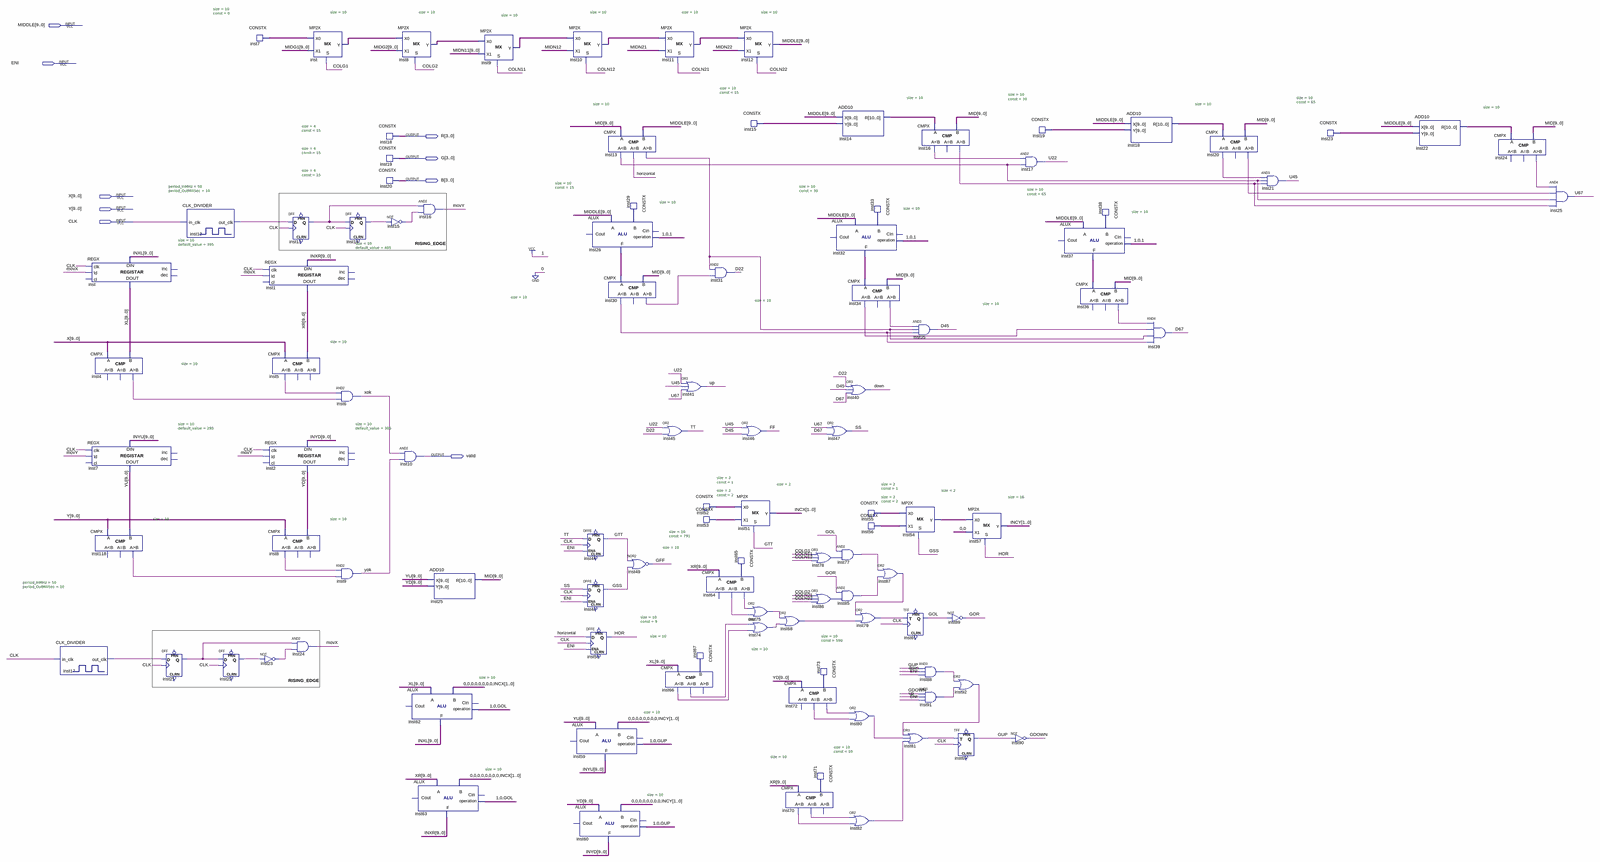
[diagram p0: schematic sheet, whole]
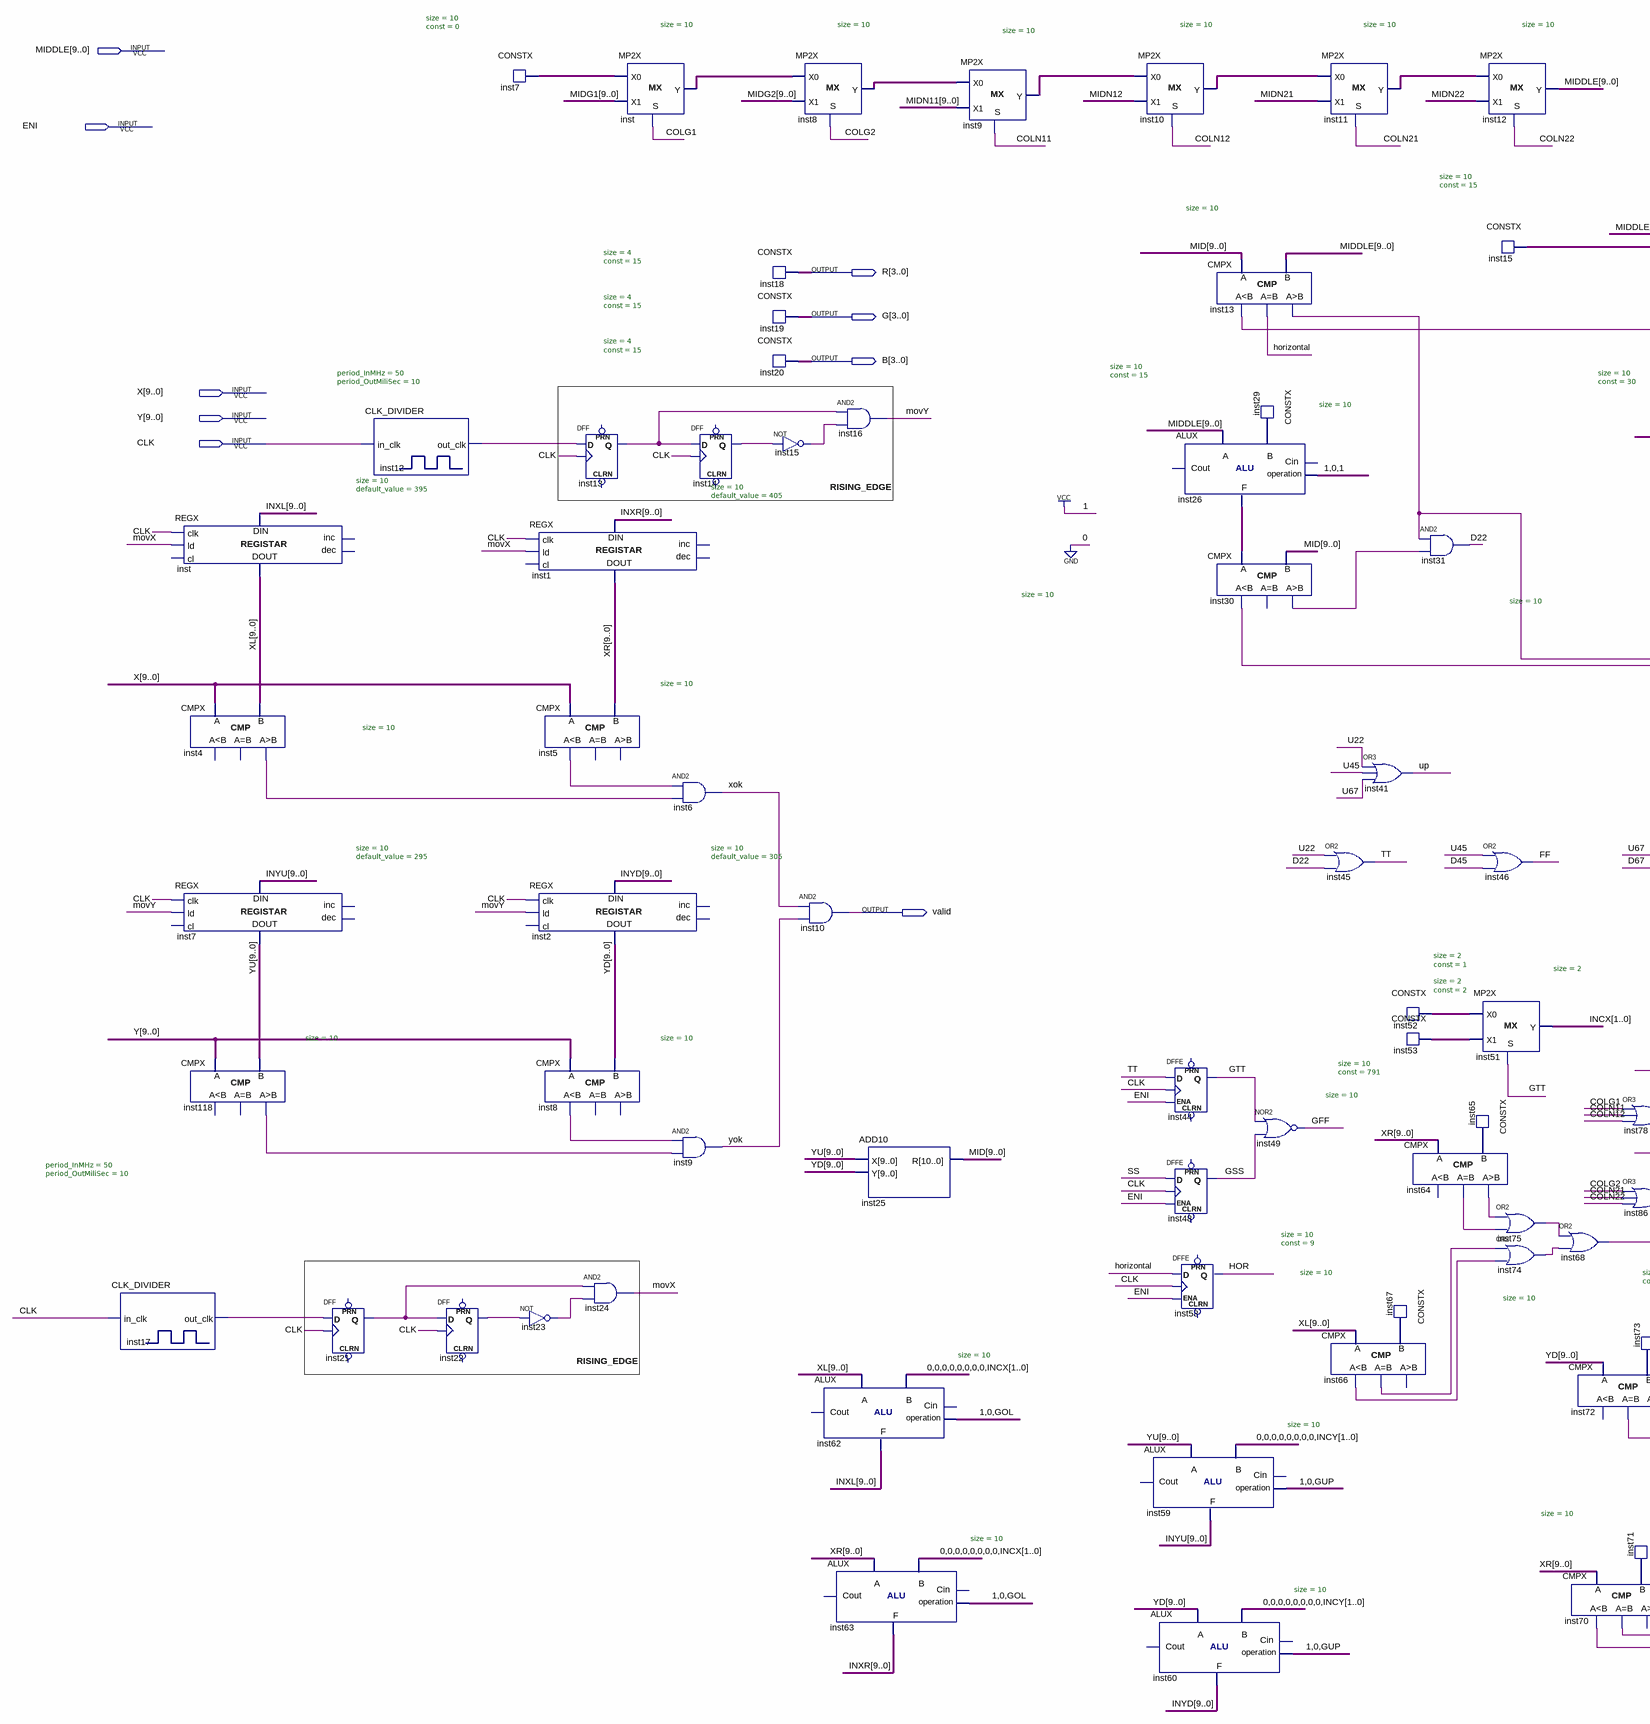
[diagram p1: schematic sheet, left part]
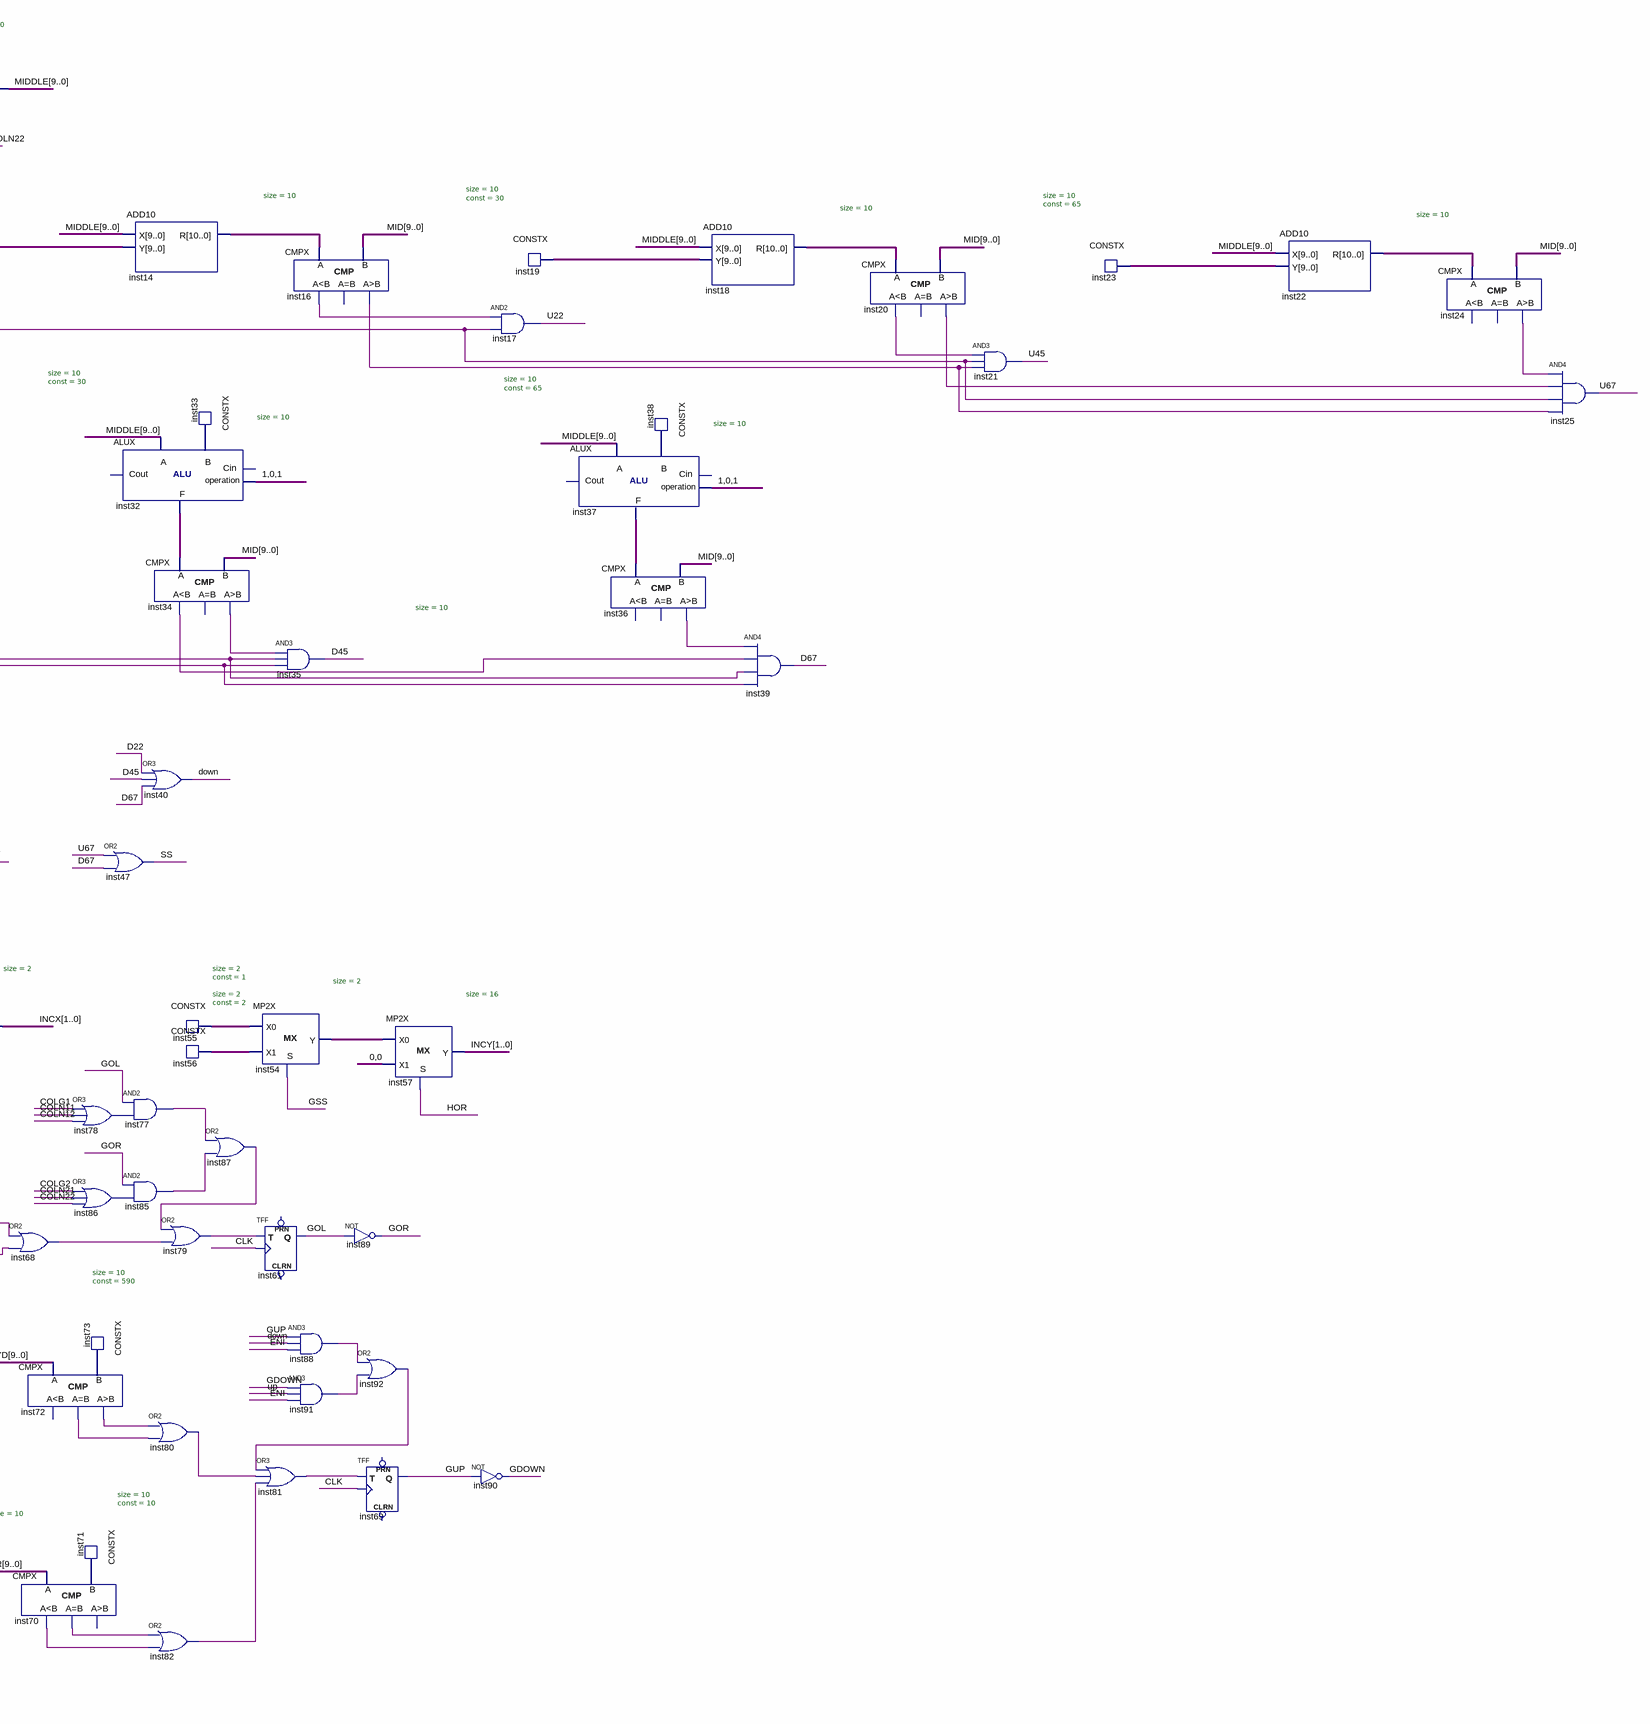
[diagram p2: schematic sheet, right part]
// Quartus schematic Loptica(Kvadratic).bdf as structural Verilog: 104 symbols, 9 pins
module \Loptica(Kvadratic)  (
  input  [9:0] MIDDLE,
  input  ENI,
  input  [9:0] X,
  input  [9:0] Y,
  input  CLK,
  output [3:0] R,
  output [3:0] G,
  output [3:0] B,
  output valid
);

  wire COLG1, COLG2, COLN11, COLN12, COLN21, COLN22, D22, D45, D67, down, FF, GDOWN, GFF, GOL, GOR, GSS, GTT,
       GUP, HOR, horizontal, inst4_gr, inst5_ls, inst8_ls, inst12_out_clk, inst13_gr, inst13_ls, inst13_q,
       inst14_q, inst15_out, inst16_gr, inst16_ls, inst17_out_clk, inst20_gr, inst20_ls, inst21_q, inst22_q,
       inst23_out, inst24_gr, inst30_gr, inst30_ls, inst34_gr, inst34_ls, inst36_gr, inst64_eq, inst64_gr,
       inst66_eq, inst66_ls, inst68_out, inst70_eq, inst70_ls, inst72_eq, inst72_gr, inst74_out, inst75_out,
       inst77_out, inst78_out, inst79_out, inst80_out, inst81_out, inst82_out, inst85_out, inst86_out,
       inst87_out, inst88_out, inst91_out, inst92_out, inst118_gr, MIDN12, MIDN21, MIDN22, movX, movY, SS,
       TT, U22, U45, U67, up, xok, yok;
  wire [1:0] INCX, INCY, inst52_data, inst53_data, inst55_data, inst56_data;
  wire [9:0] inst7_data, inst8_y, inst9_y, inst10_y, inst11_y, inst15_data, inst19_data, inst23_data,
       inst26_f, inst29_data, inst32_f, inst33_data, inst37_f, inst38_data, inst65_data, inst67_data,
       inst71_data, inst73_data, inst_y, INXL, INXR, INYD, INYU, MID, MIDG1, MIDG2, MIDN11, XL, XR, YD, YU;
  wire [10:0] inst14_r, inst18_r, inst22_r;
  wire [15:0] inst54_y;

  CLK_DIVIDER #(.period_InMHz(50), .period_OutMiliSec(10)) inst17 (.in_clk(CLK), .out_clk(inst17_out_clk));
  REGX #(.size(10), .default_value(395)) inst (
    .clk(CLK), .ld(movX), .data_in(INXL), .data_out(XL));  // open: cl, inc, dec
  CMPX #(.size(10)) inst4 (.A(X), .B(XL), .gr(inst4_gr));  // open: ls, eq
  REGX #(.size(10), .default_value(295)) inst7 (
    .clk(CLK), .ld(movY), .data_in(INYU), .data_out(YU));  // open: cl, inc, dec
  CMPX #(.size(10)) inst118 (.A(Y), .B(YU), .gr(inst118_gr));  // open: ls, eq
  DFF inst21 (.CLK(CLK), .D(inst17_out_clk), .Q(inst21_q));  // open: CLRN, PRN
  CLK_DIVIDER #(.period_InMHz(50), .period_OutMiliSec(10)) inst12 (.in_clk(CLK), .out_clk(inst12_out_clk));
  DFF inst22 (.CLK(CLK), .D(inst21_q), .Q(inst22_q));  // open: CLRN, PRN
  CONSTX #(.size(10), .\const (0)) inst7_dup2 (.data(inst7_data));
  REGX #(.size(10), .default_value(405)) inst1 (
    .clk(CLK), .ld(movX), .data_in(INXR), .data_out(XR));  // open: cl, inc, dec
  CMPX #(.size(10)) inst5 (.A(X), .B(XR), .ls(inst5_ls));  // open: eq, gr
  REGX #(.size(10), .default_value(305)) inst2 (
    .clk(CLK), .ld(movY), .data_in(INYD), .data_out(YD));  // open: cl, inc, dec
  CMPX #(.size(10)) inst8 (.A(Y), .B(YD), .ls(inst8_ls));  // open: eq, gr
  not inst23 (inst23_out, inst22_q);
  DFF inst13 (.CLK(CLK), .D(inst12_out_clk), .Q(inst13_q));  // open: CLRN, PRN
  and inst24 (movX, inst21_q, inst23_out);
  MP2X #(.size(10)) inst_dup2 (.S(COLG1), .X0(inst7_data), .X1(MIDG1), .Y(inst_y));
  DFF inst14 (.CLK(CLK), .D(inst13_q), .Q(inst14_q));  // open: CLRN, PRN
  and inst6 (xok, inst5_ls, inst4_gr);
  and inst9 (yok, inst8_ls, inst118_gr);
  MP2X #(.size(10)) inst8_dup2 (.S(COLG2), .X0(inst_y), .X1(MIDG2), .Y(inst8_y));
  CONSTX #(.size(4), .\const (15)) inst18 (.data(R));
  CONSTX #(.size(4), .\const (15)) inst19 (.data(G));
  CONSTX #(.size(4), .\const (15)) inst20 (.data(B));
  not inst15 (inst15_out, inst14_q);
  and inst10 (valid, xok, yok);
  and inst16 (movY, inst13_q, inst15_out);
  ALUX #(.size(10)) inst62 (.B({{8{1'b0}}, INCX}), .A(XL), .op({2'b10, GOL}), .F(INXL));  // open: Cin, Cout
  ALUX #(.size(10)) inst63 (.B({{8{1'b0}}, INCX}), .A(XR), .op({2'b10, GOL}), .F(INXR));  // open: Cin, Cout
  ADD10 inst25 (.X(YU), .Y(YD), .R(MID));
  MP2X #(.size(10)) inst9_dup2 (.S(COLN11), .X0(inst8_y), .X1(MIDN11), .Y(inst9_y));
  MP2X #(.size(10)) inst10_dup2 (.S(COLN12), .X0(inst9_y), .X1({10{MIDN12}}), .Y(inst10_y));
  ALUX #(.size(10)) inst59 (.B({{8{1'b0}}, INCY}), .A(YU), .op({2'b10, GUP}), .F(INYU));  // open: Cin, Cout
  ALUX #(.size(10)) inst60 (.B({{8{1'b0}}, INCY}), .A(YD), .op({2'b10, GUP}), .F(INYD));  // open: Cin, Cout
  CMPX #(.size(10)) inst13_dup2 (.A(MID), .B(MIDDLE), .ls(inst13_ls), .eq(horizontal), .gr(inst13_gr));
  ALUX #(.size(10)) inst26 (.B(inst29_data), .A(MIDDLE), .op(3'b101), .F(inst26_f));  // open: Cin, Cout
  CMPX #(.size(10)) inst30 (.A(inst26_f), .B(MID), .ls(inst30_ls), .gr(inst30_gr));  // open: eq
  DFFE inst44 (.D(TT), .CLK(CLK), .ENA(ENI), .Q(GTT));  // open: PRN, CLRN
  DFFE inst48 (.D(SS), .CLK(CLK), .ENA(ENI), .Q(GSS));  // open: PRN, CLRN
  DFFE inst58 (.D(horizontal), .CLK(CLK), .ENA(ENI), .Q(HOR));  // open: PRN, CLRN
  CONSTX #(.size(10), .\const (15)) inst29 (.data(inst29_data));
  nor inst49 (GFF, GTT, GSS);
  MP2X #(.size(10)) inst11 (.S(COLN21), .X0(inst10_y), .X1({10{MIDN21}}), .Y(inst11_y));
  or inst45 (TT, U22, D22);
  CMPX #(.size(10)) inst66 (.A(XL), .B(inst67_data), .ls(inst66_ls), .eq(inst66_eq));  // open: gr
  or inst41 (up, U22, U45, U67);
  CONSTX #(.size(2), .\const (1)) inst52 (.data(inst52_data));
  CONSTX #(.size(2), .\const (2)) inst53 (.data(inst53_data));
  CMPX #(.size(10)) inst64 (.A(XR), .B(inst65_data), .eq(inst64_eq), .gr(inst64_gr));  // open: ls
  CONSTX #(.size(10), .\const (9)) inst67 (.data(inst67_data));
  and inst31 (D22, inst13_gr, inst30_gr);
  MP2X #(.size(10)) inst12_dup2 (.S(COLN22), .X0(inst11_y), .X1({10{MIDN22}}), .Y(MIDDLE));
  CONSTX #(.size(10), .\const (15)) inst15_dup2 (.data(inst15_data));
  or inst46 (FF, U45, D45);
  MP2X #(.size(2)) inst51 (.S(GTT), .X0(inst52_data), .X1(inst53_data), .Y(INCX));
  CONSTX #(.size(10), .\const (791)) inst65 (.data(inst65_data));
  or inst75 (inst75_out, inst64_gr, inst64_eq);
  or inst74 (inst74_out, inst66_eq, inst66_ls);
  or inst68 (inst68_out, inst75_out, inst74_out);
  CMPX #(.size(10)) inst70 (.A(XR), .B(inst71_data), .ls(inst70_ls), .eq(inst70_eq));  // open: gr
  CMPX #(.size(10)) inst72 (.A(YD), .B(inst73_data), .eq(inst72_eq), .gr(inst72_gr));  // open: ls
  ALUX #(.size(10)) inst32 (.B(inst33_data), .A(MIDDLE), .op(3'b101), .F(inst32_f));  // open: Cin, Cout
  or inst47 (SS, U67, D67);
  or inst78 (inst78_out, COLG1, COLN11, COLN12);
  or inst86 (inst86_out, COLG2, COLN21, COLN22);
  CONSTX #(.size(10), .\const (590)) inst73 (.data(inst73_data));
  CONSTX #(.size(10), .\const (10)) inst71 (.data(inst71_data));
  ADD10 inst14_dup2 (.X(MIDDLE), .Y(inst15_data), .R(inst14_r));
  CMPX #(.size(10)) inst34 (.A(inst32_f), .B(MID), .ls(inst34_ls), .gr(inst34_gr));  // open: eq
  or inst40 (down, D22, D45, D67);
  and inst77 (inst77_out, GOL, inst78_out);
  and inst85 (inst85_out, GOR, inst86_out);
  or inst79 (inst79_out, inst87_out, inst68_out);
  or inst80 (inst80_out, inst72_gr, inst72_eq);
  or inst82 (inst82_out, inst70_eq, inst70_ls);
  CONSTX #(.size(10), .\const (30)) inst33 (.data(inst33_data));
  CONSTX #(.size(2), .\const (1)) inst55 (.data(inst55_data));
  CONSTX #(.size(2), .\const (2)) inst56 (.data(inst56_data));
  or inst87 (inst87_out, inst77_out, inst85_out);
  MP2X #(.size(2)) inst54 (.S(GSS), .X0(inst55_data), .X1(inst56_data), .Y(inst54_y));
  TFF inst61 (.T(inst79_out), .CLK(CLK), .Q(GOL));  // open: PRN, CLRN
  or inst81 (inst81_out, inst92_out, inst80_out, inst82_out);
  CMPX #(.size(10)) inst16_dup2 (.A(inst14_r), .B(MID), .ls(inst16_ls), .gr(inst16_gr));  // open: eq
  and inst35 (D45, inst34_gr, inst13_gr, inst30_ls);
  and inst88 (inst88_out, GUP, down, ENI);
  and inst91 (inst91_out, GDOWN, up, ENI);
  not inst89 (GOR, GOL);
  or inst92 (inst92_out, inst88_out, inst91_out);
  TFF inst69 (.T(inst81_out), .CLK(CLK), .Q(GUP));  // open: PRN, CLRN
  MP2X #(.size(16)) inst57 (.S(HOR), .X0(inst54_y), .X1(2'b00), .Y(INCY));
  CONSTX #(.size(10), .\const (30)) inst19_dup2 (.data(inst19_data));
  and inst17_dup2 (U22, inst16_ls, inst13_ls);
  not inst90 (GDOWN, GUP);
  ALUX #(.size(10)) inst37 (.B(inst38_data), .A(MIDDLE), .op(3'b101), .F(inst37_f));  // open: Cin, Cout
  CMPX #(.size(10)) inst36 (.A(inst37_f), .B(MID), .gr(inst36_gr));  // open: ls, eq
  CONSTX #(.size(10), .\const (65)) inst38 (.data(inst38_data));
  ADD10 inst18_dup2 (.X(MIDDLE), .Y(inst19_data), .R(inst18_r));
  and inst39 (D67, inst36_gr, inst34_ls, inst13_gr, inst30_ls);
  CMPX #(.size(10)) inst20_dup2 (.A(inst18_r), .B(MID), .ls(inst20_ls), .gr(inst20_gr));  // open: eq
  and inst21_dup2 (U45, inst20_ls, inst13_ls, inst16_gr);
  CONSTX #(.size(10), .\const (65)) inst23_dup2 (.data(inst23_data));
  ADD10 inst22_dup2 (.X(MIDDLE), .Y(inst23_data), .R(inst22_r));
  CMPX #(.size(10)) inst24_dup2 (.A(inst22_r), .B(MID), .gr(inst24_gr));  // open: ls, eq
  and inst25_dup2 (U67, inst24_gr, inst20_gr, inst13_ls, inst16_gr);

  // Notes on the sheet:
  //   RISING_EDGE
  //   RISING_EDGE
endmodule
